# Altium project SERVO.PrjPcb
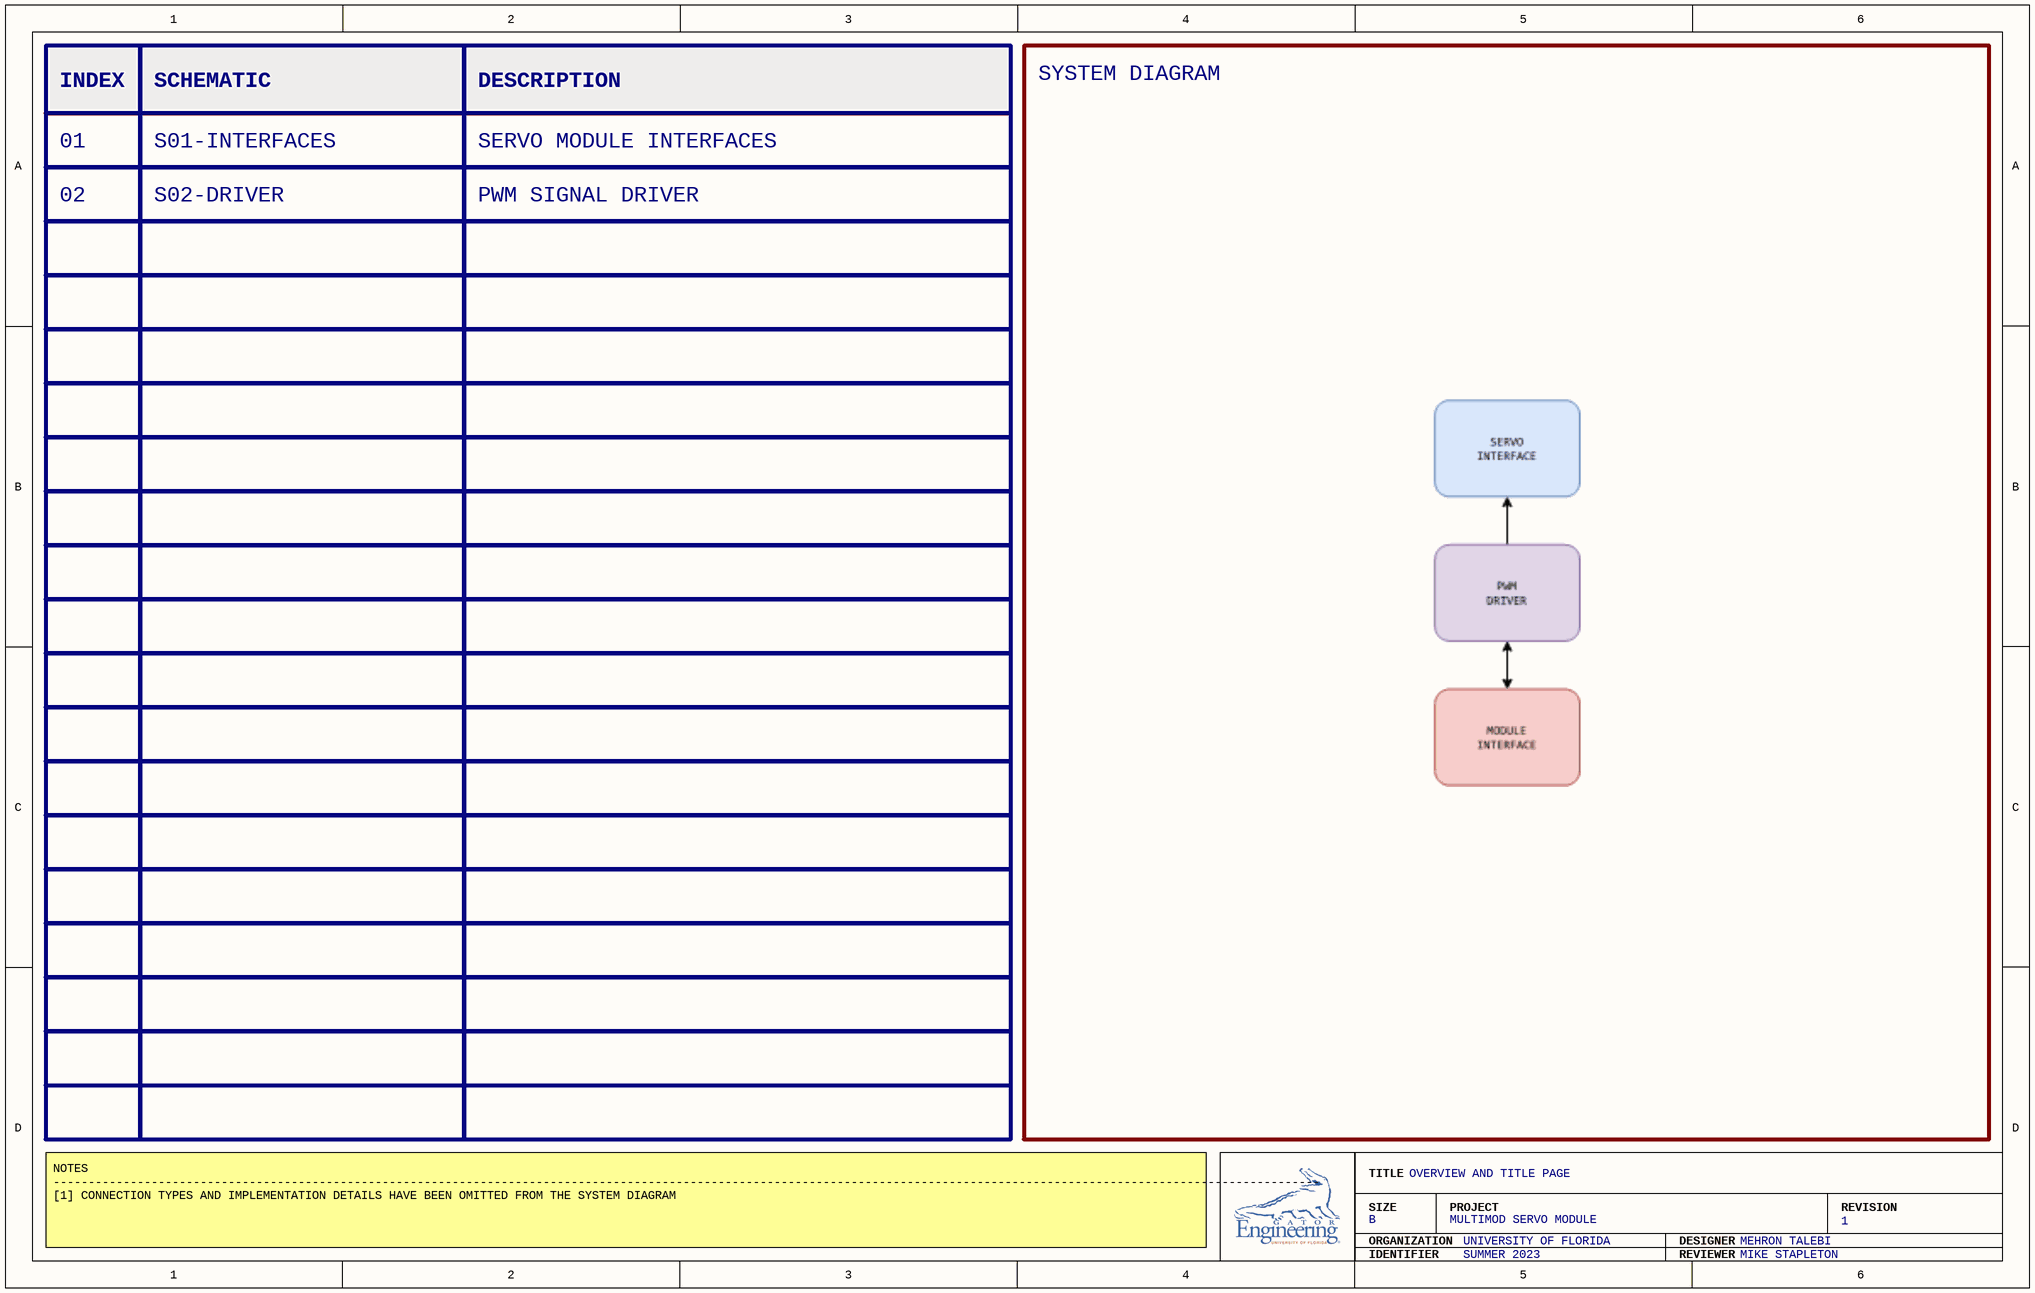
[diagram p0: S00-OVERVIEW.SchDoc]
3 sheets, 16 parts. Net scope: flat (ports and power ports of the same name join across sheets).
Board file: P01-SERVO.PcbDoc
Sheets:
  S00-OVERVIEW.SchDoc
  S01-INTERFACES.SchDoc
  S02-DRIVER.SchDoc

## Sheet S00-OVERVIEW.SchDoc
size B; SheetNumber: 1; SheetTotal: 3; BLOCK-TITLE: OVERVIEW AND TITLE PAGE; BLOCK-SIZE: B; BLOCK-PROJECT: MULTIMOD SERVO MODULE; BLOCK-REVISION: 1; BLOCK-ORGANIZATION: UNIVERSITY OF FLORIDA; BLOCK-DESIGNER: MEHRON TALEBI; BLOCK-IDENTIFIER: SUMMER 2023; BLOCK-REVIEWER: MIKE STAPLETON

### Notes on the sheet
- INDEX
- SCHEMATIC
- DESCRIPTION
- SYSTEM DIAGRAM
- 01
- S01-INTERFACES
- SERVO MODULE INTERFACES
- 02
- S02-DRIVER
- PWM SIGNAL DRIVER
- NOTES
  -------------------------------------------------------------------------------------------------------------------------------------------------------------------------------------
  [1] CONNECTION TYPES AND IMPLEMENTATION DETAILS HAVE BEEN OMITTED FROM THE SYSTEM DIAGRAM
- TITLE
- SIZE
- ORGANIZATION
- PROJECT
- DESIGNER
- REVISION
- IDENTIFIER
- REVIEWER

## Sheet S01-INTERFACES.SchDoc
size B; SheetNumber: 2; SheetTotal: 3; BLOCK-TITLE: SERVO MODULE INTERFACES; BLOCK-SIZE: B; BLOCK-PROJECT: MULTIMOD SERVO MODULE; BLOCK-REVISION: 1; BLOCK-ORGANIZATION: UNIVERSITY OF FLORIDA; BLOCK-DESIGNER: MEHRON TALEBI; BLOCK-IDENTIFIER: SUMMER 2023; BLOCK-REVIEWER: MIKE STAPLETON
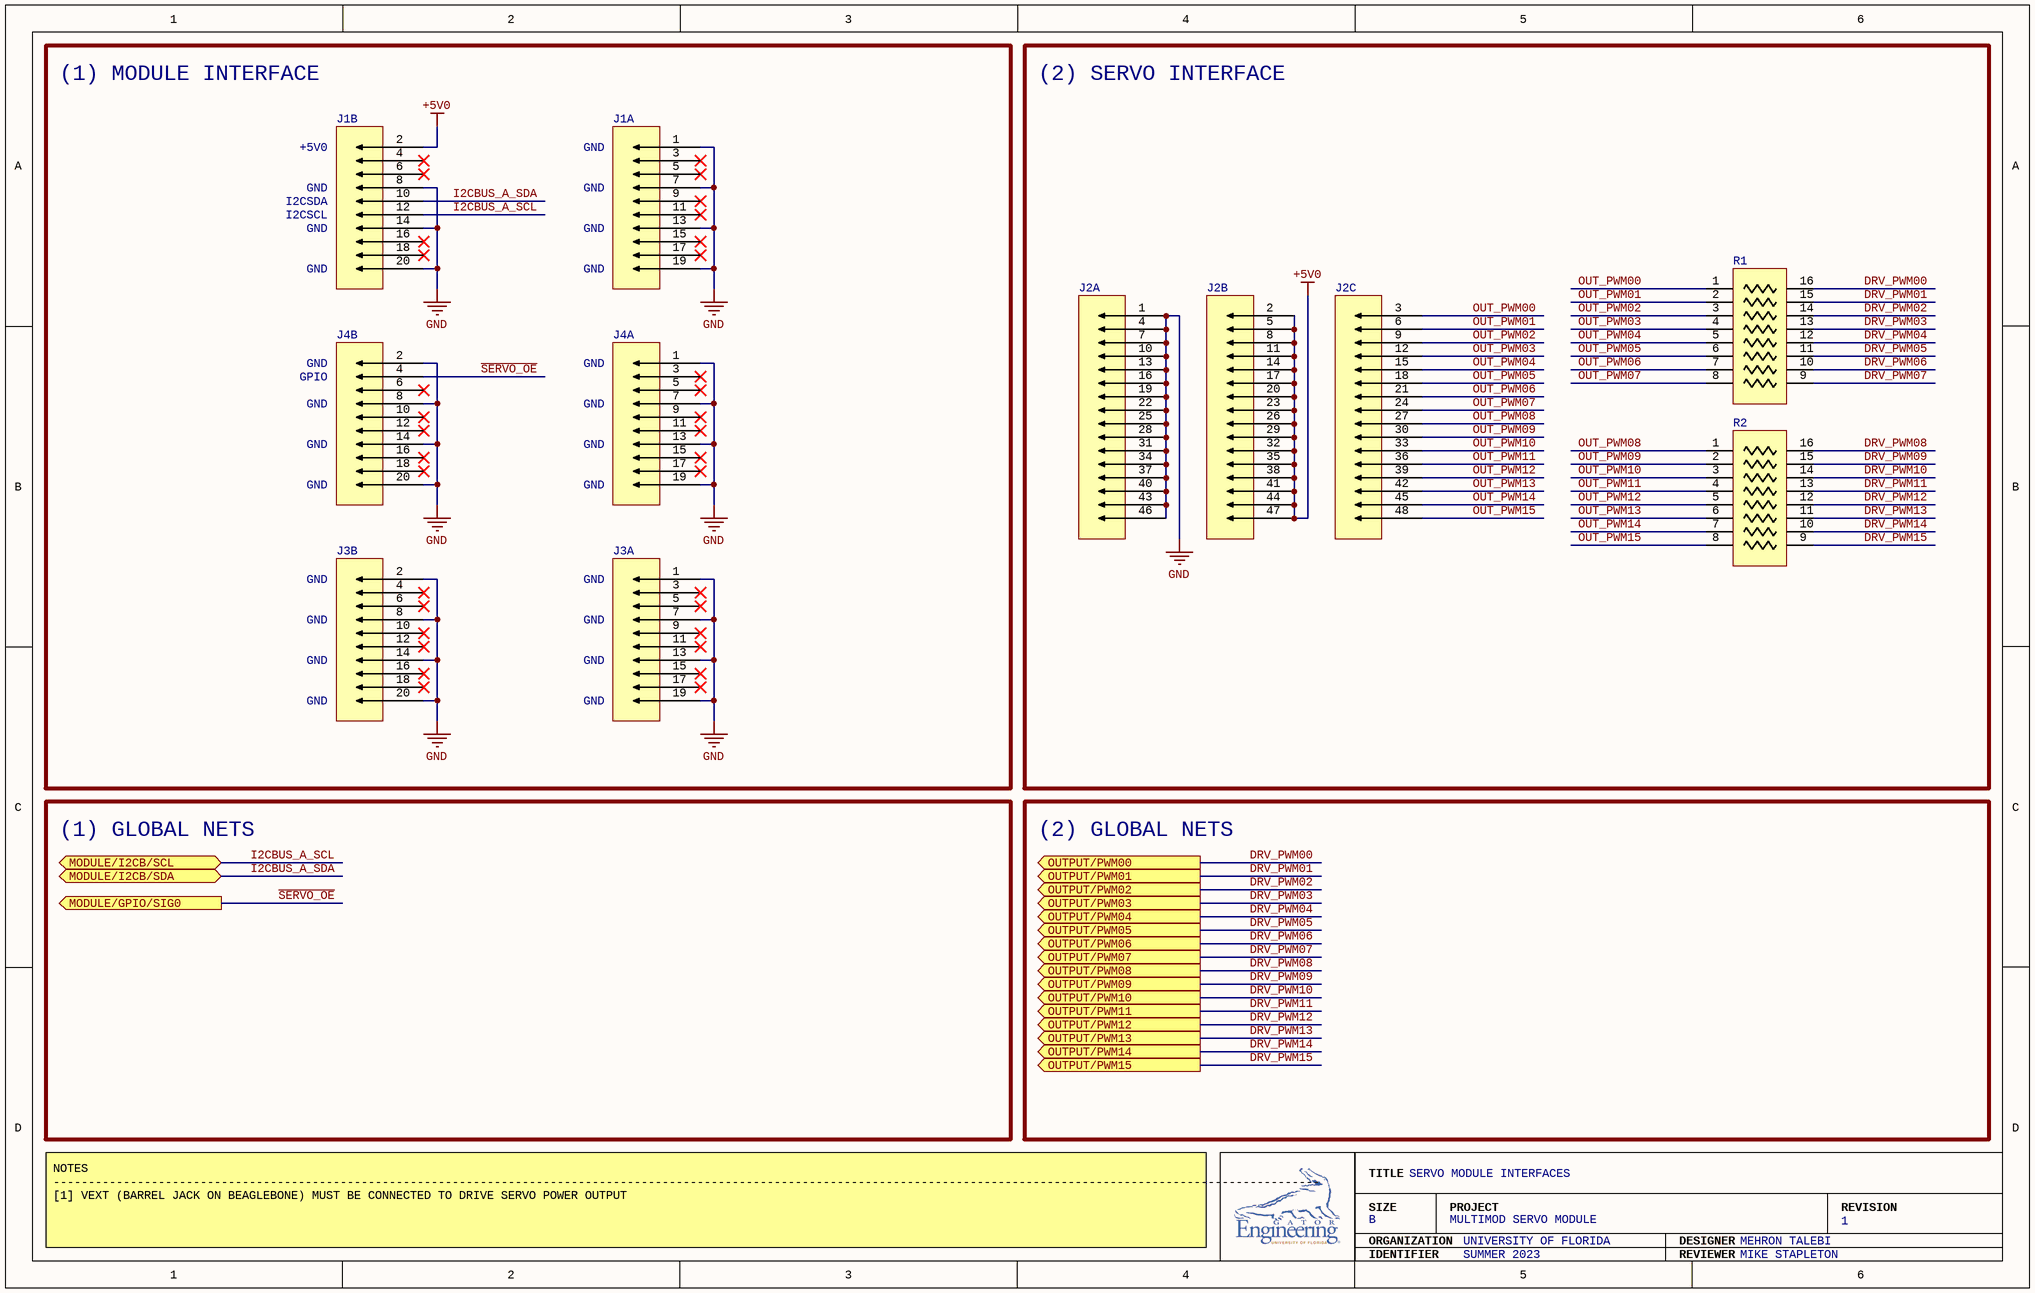
[diagram p1: S01-INTERFACES.SchDoc]

### Parts
J1  NPTC102KFMS-RC  [NPTC102KFMS-RC]  (value not drawn)  (parts A,B of 2)
J2  TSW-116-07-L-T  [TSW-116-07-L-T]  (value not drawn)  (parts A,B,C of 3)
J3  NPTC102KFMS-RC  [NPTC102KFMS-RC]  (value not drawn)  (parts A,B of 2)
J4  NPTC102KFMS-RC  [NPTC102KFMS-RC]  (value not drawn)  (parts A,B of 2)
R1  EXB-2HV221JV  [EXB-2HV221JV]  (value not drawn)
R2  EXB-2HV221JV  [EXB-2HV221JV]  (value not drawn)

### Blocks framed on the sheet
(1) MODULE INTERFACE: J1 J3 J4
(2) SERVO INTERFACE: J2 R1 R2

### Ports
MODULE/GPIO/SIG0 (out), MODULE/I2CB/SCL (bidir), MODULE/I2CB/SDA (bidir), OUTPUT/PWM00 (out), OUTPUT/PWM01 (out), OUTPUT/PWM02 (out), OUTPUT/PWM03 (out), OUTPUT/PWM04 (out), OUTPUT/PWM05 (out), OUTPUT/PWM06 (out), OUTPUT/PWM07 (out), OUTPUT/PWM08 (out), OUTPUT/PWM09 (out), OUTPUT/PWM10 (out), OUTPUT/PWM11 (out), OUTPUT/PWM12 (out), OUTPUT/PWM13 (out), OUTPUT/PWM14 (out), OUTPUT/PWM15 (out)

### Nets
+5V0: J1.2 J2.2 J2.5 J2.8 J2.11 J2.14 J2.17 J2.20 J2.23 J2.26 J2.29 J2.32 J2.35 J2.38 J2.41 J2.44 J2.47
GND: J1.1 J1.7 J1.8 J1.13 J1.14 J1.19 J1.20 J2.1 J2.4 J2.7 J2.10 J2.13 J2.16 J2.19 J2.22 J2.25 J2.28 J2.31 J2.34 J2.37 J2.40 J2.43 J2.46 J3.1 J3.2 J3.7 J3.8 J3.13 J3.14 J3.19 J3.20 J4.1 J4.2 J4.7 J4.8 J4.13 J4.14 J4.19 J4.20
~{SERVO_OE}: J4.4 ; port MODULE/GPIO/SIG0
DRV_PWM00: R1.16 ; port OUTPUT/PWM00
DRV_PWM01: R1.15 ; port OUTPUT/PWM01
DRV_PWM02: R1.14 ; port OUTPUT/PWM02
DRV_PWM03: R1.13 ; port OUTPUT/PWM03
DRV_PWM04: R1.12 ; port OUTPUT/PWM04
DRV_PWM05: R1.11 ; port OUTPUT/PWM05
DRV_PWM06: R1.10 ; port OUTPUT/PWM06
DRV_PWM07: R1.9 ; port OUTPUT/PWM07
DRV_PWM08: R2.16 ; port OUTPUT/PWM08
DRV_PWM09: R2.15 ; port OUTPUT/PWM09
DRV_PWM10: R2.14 ; port OUTPUT/PWM10
DRV_PWM11: R2.13 ; port OUTPUT/PWM11
DRV_PWM12: R2.12 ; port OUTPUT/PWM12
DRV_PWM13: R2.11 ; port OUTPUT/PWM13
DRV_PWM14: R2.10 ; port OUTPUT/PWM14
DRV_PWM15: R2.9 ; port OUTPUT/PWM15
I2CBUS_A_SCL: J1.12 ; port MODULE/I2CB/SCL
I2CBUS_A_SDA: J1.10 ; port MODULE/I2CB/SDA
OUT_PWM00: J2.3 R1.1
OUT_PWM01: J2.6 R1.2
OUT_PWM02: J2.9 R1.3
OUT_PWM03: J2.12 R1.4
OUT_PWM04: J2.15 R1.5
OUT_PWM05: J2.18 R1.6
OUT_PWM06: J2.21 R1.7
OUT_PWM07: J2.24 R1.8
OUT_PWM08: J2.27 R2.1
OUT_PWM09: J2.30 R2.2
OUT_PWM10: J2.33 R2.3
OUT_PWM11: J2.36 R2.4
OUT_PWM12: J2.39 R2.5
OUT_PWM13: J2.42 R2.6
OUT_PWM14: J2.45 R2.7
OUT_PWM15: J2.48 R2.8

Not connected (* = marked no-connect by the designer): J1 3* 4* 5* 6* 9* 11* 15* 16* 17* 18*; J3 3* 4* 5* 6* 9* 10* 11* 12* 15* 16* 17* 18*; J4 3* 5* 6* 9* 10* 11* 12* 15* 16* 17* 18*

### Notes on the sheet
- +5V0
- GND
- I2CSCL
- I2CSDA
- GPIO
- (1) GLOBAL NETS
- (2) GLOBAL NETS
- NOTES
  -------------------------------------------------------------------------------------------------------------------------------------------------------------------------------------
  [1] VEXT (BARREL JACK ON BEAGLEBONE) MUST BE CONNECTED TO DRIVE SERVO POWER OUTPUT
- TITLE
- SIZE
- ORGANIZATION
- PROJECT
- DESIGNER
- REVISION
- IDENTIFIER
- REVIEWER

### Library data of the parts
J1 J3 J4 = NPTC102KFMS-RC: CONN HDR 20POS 0.1 TIN SMD; Connector Type: Header; Style: Board to Board; Number of Positions: 20; Number of Positions Loaded: All; Pitch - Mating: 0.100" (2.54mm); Material Flammability Rating: UL94 V-0; Current Rating (Amps): 3A; Voltage Rating: 250V; System: Connector; Contact Type: Female Socket; Number of Rows: 2; Row Spacing - Mating: 0.100" (2.54mm); Mounting Type: Surface Mount; Termination: Solder; Fastening Type: Push-Pull; Contact Finish - Mating: Tin; Insulation Color: Black; Insulation Height: 0.299" (7.60mm); Operating Temperature: -40°C ~ 125°C; Contact Finish - Post: Tin; Insulation Material: Polyamide (PA6T), Nylon 6T; Contact Shape: Square; Contact Material: Phosphor Bronze; Supplier 1: Digi-Key; Supplier Part Number 1: S5680-ND
J2 = TSW-116-07-L-T: CONN HEADER VERT 48POS 2.54MM; Pitch - Mating: 0.100" (2.54mm); Number of Positions: 48; Number of Positions Loaded: All; Style: Board to Board or Cable; Shrouding: Unshrouded; Contact Length - Mating: 0.230" (5.84mm); Material Flammability Rating: UL94 V-0; Connector Type: Header; Contact Type: Male Pin; Number of Rows: 3; Row Spacing - Mating: 0.100" (2.54mm); Mounting Type: Through Hole, Right Angle; Termination: Solder; Fastening Type: Push-Pull; Contact Length - Post: 0.100" (2.54mm); Insulation Height: 0.100" (2.54mm); Contact Shape: Square; Contact Finish - Mating: Gold; Contact Finish Thickness - Mating: 10.0µin (0.25µm); Contact Finish - Post: Gold; Contact Material: Phosphor Bronze; Insulation Material: Polybutylene Terephthalate (PBT); Operating Temperature: -55°C ~ 125°C; Insulation Color: Black; Contact Finish Thickness - Post: 10.0µin (0.25µm); Supplier 1: Digi-Key; Supplier Part Number 1: SAM12360-ND
R1 R2 = EXB-2HV221JV: RES ARRAY 8 RES 220 OHM 1506; Circuit Type: Isolated; Resistance (Ohms): 220; Tolerance: ±5%; Number of Resistors: 8; Power Per Element: 62.5mW; Temperature Coefficient: ±200ppm/°C; Number of Pins: 16; Operating Temperature: -55°C ~ 125°C; Applications: Automotive AEC-Q200; Mounting Type: Surface Mount; Package / Case: 1506, Convex, Long Side Terminals; Size / Dimension: 0.150" L x 0.063" W (3.80mm x 1.60mm); Height - Seated (Max): 0.022" (0.55mm); Supplier 1: Mouser; Supplier Part Number 1: 667-EXB-2HV221JV

## Sheet S02-DRIVER.SchDoc
size B; SheetNumber: 3; SheetTotal: 3; BLOCK-TITLE: PWM SIGNAL DRIVER; BLOCK-SIZE: B; BLOCK-PROJECT: MULTIMOD SERVO MODULE; BLOCK-REVISION: 1; BLOCK-ORGANIZATION: UNIVERSITY OF FLORIDA; BLOCK-DESIGNER: MEHRON TALEBI; BLOCK-IDENTIFIER: SUMMER 2023; BLOCK-REVIEWER: MIKE STAPLETON
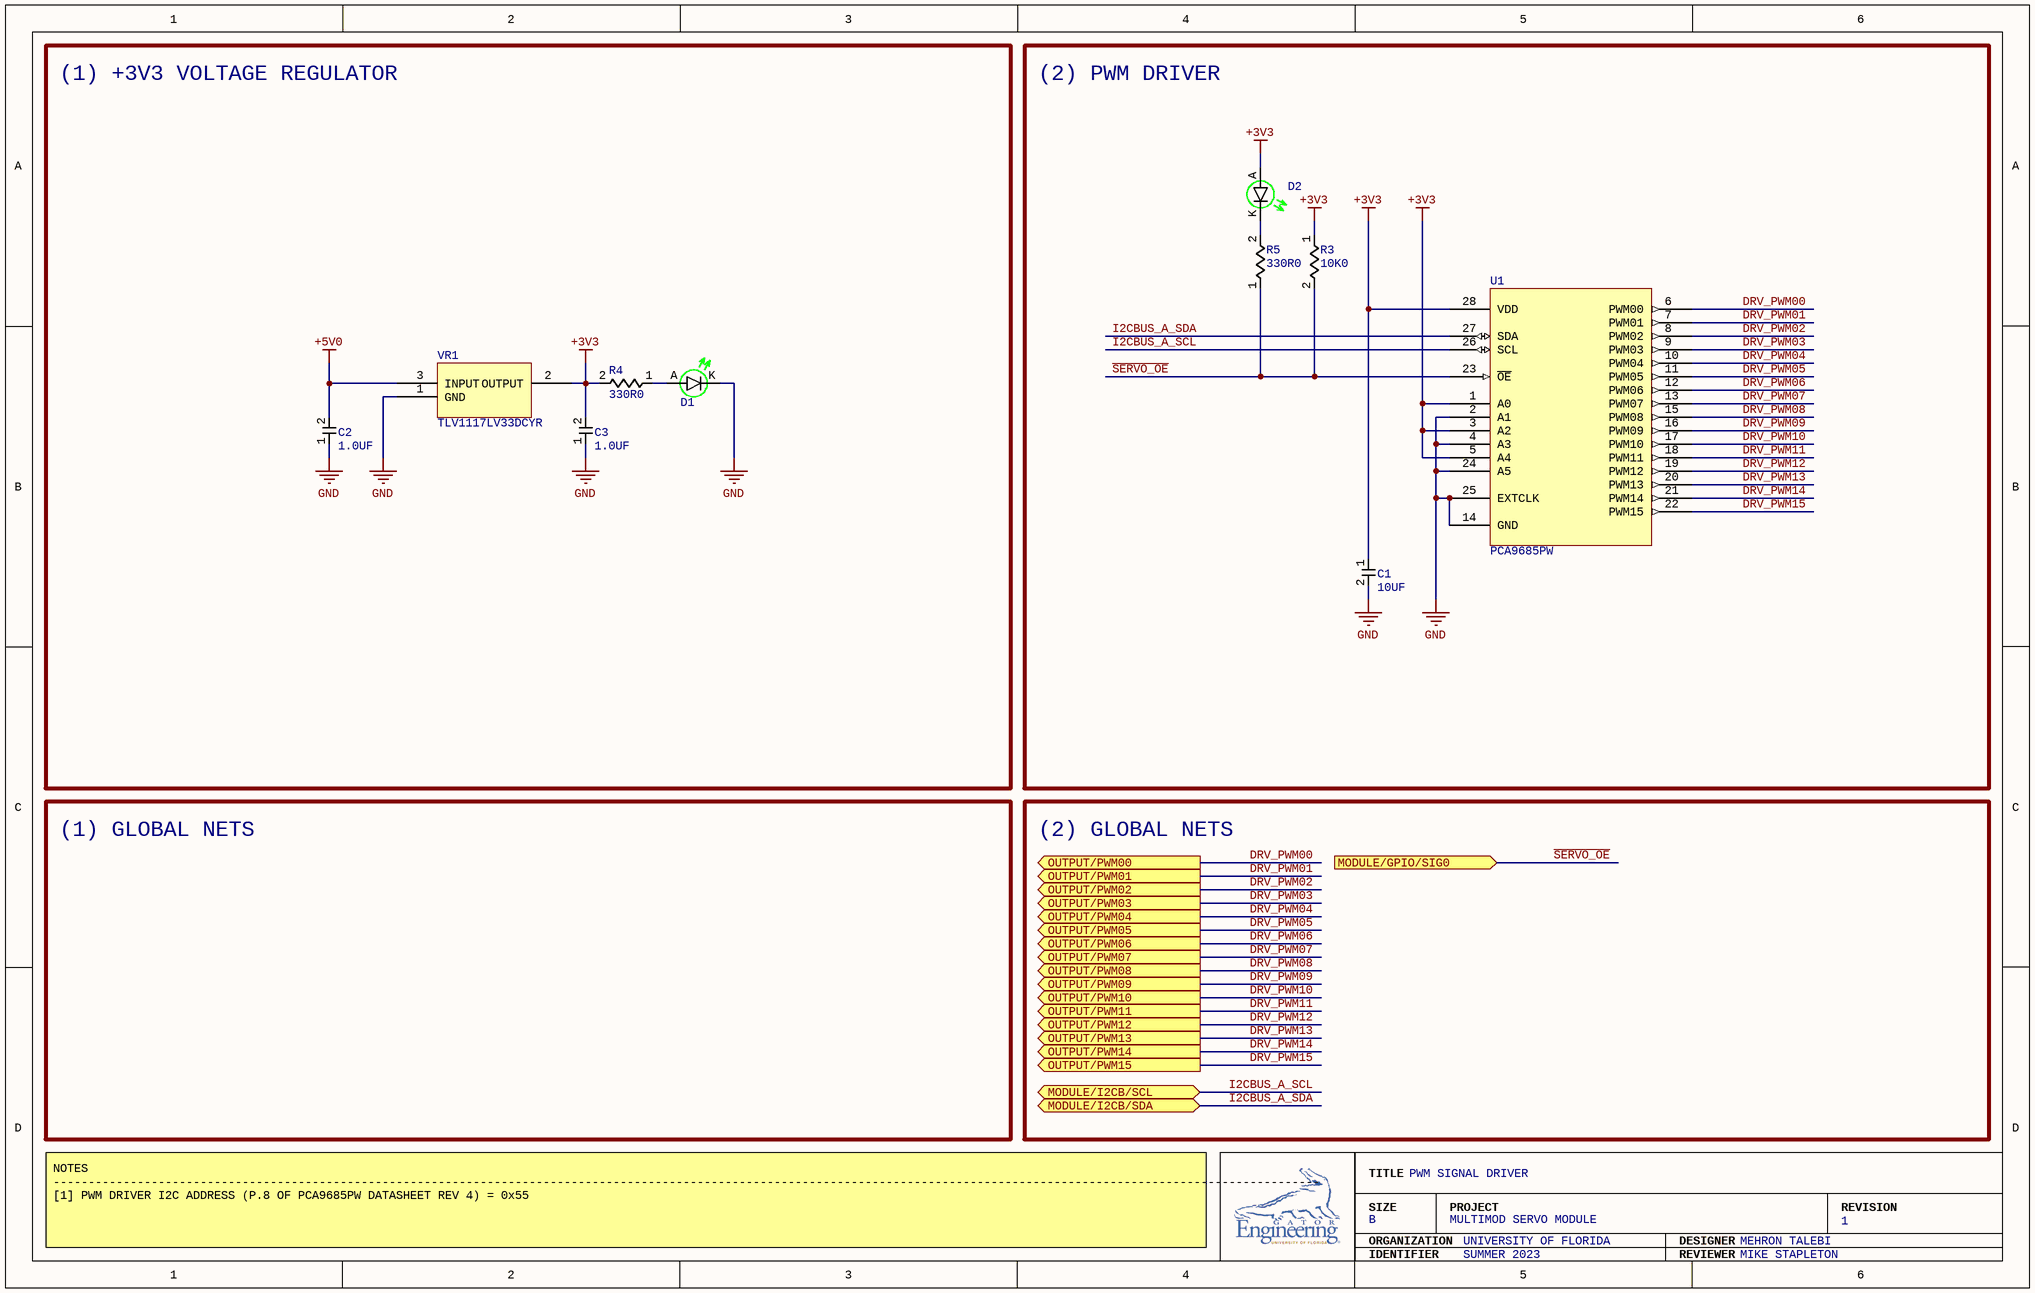
[diagram p2: S02-DRIVER.SchDoc]

### Parts
C1  10UF  [CL21B106KPQNFNE]
C2  1.0UF  [CL21B105KAFNFNE]
C3  1.0UF  [CL21B105KAFNFNE]
D1  LTST-C171GKT  [LTST-C171GKT]  (value not drawn)
D2  LTST-C171GKT  [LTST-C171GKT]  (value not drawn)
R3  10K0  [RC0805FR-0710KL]
R4  330R0  [RC0805FR-7W330RL]
R5  330R0  [RC0805FR-7W330RL]
U1  PCA9685PW  [PCA9685PW]
VR1  TLV1117LV33DCYR  [TLV1117LV33DCYR]

### Blocks framed on the sheet
(1) +3V3 VOLTAGE REGULATOR: C2 C3 D1 R4 VR1
(2) PWM DRIVER: C1 D2 R3 R5 U1

### Ports
MODULE/GPIO/SIG0 (in), MODULE/I2CB/SCL (bidir), MODULE/I2CB/SDA (bidir), OUTPUT/PWM00 (out), OUTPUT/PWM01 (out), OUTPUT/PWM02 (out), OUTPUT/PWM03 (out), OUTPUT/PWM04 (out), OUTPUT/PWM05 (out), OUTPUT/PWM06 (out), OUTPUT/PWM07 (out), OUTPUT/PWM08 (out), OUTPUT/PWM09 (out), OUTPUT/PWM10 (out), OUTPUT/PWM11 (out), OUTPUT/PWM12 (out), OUTPUT/PWM13 (out), OUTPUT/PWM14 (out), OUTPUT/PWM15 (out)

### Nets
+3V3: C1.1 C3.2 D2.A R3.1 R4.2 U1.1(A0) U1.3(A2) U1.5(A4) U1.28(VDD) VR1.2(OUTPUT)
+5V0: C2.2 VR1.3(INPUT)
GND: C1.2 C2.1 C3.1 D1.K U1.2(A1) U1.4(A3) U1.14(GND) U1.24(A5) U1.25(EXTCLK) VR1.1(GND)
~{SERVO_OE}: R3.2 R5.1 U1.23(~{OE}) ; port MODULE/GPIO/SIG0
DRV_PWM00: U1.6(PWM00) ; port OUTPUT/PWM00
DRV_PWM01: U1.7(PWM01) ; port OUTPUT/PWM01
DRV_PWM02: U1.8(PWM02) ; port OUTPUT/PWM02
DRV_PWM03: U1.9(PWM03) ; port OUTPUT/PWM03
DRV_PWM04: U1.10(PWM04) ; port OUTPUT/PWM04
DRV_PWM05: U1.11(PWM05) ; port OUTPUT/PWM05
DRV_PWM06: U1.12(PWM06) ; port OUTPUT/PWM06
DRV_PWM07: U1.13(PWM07) ; port OUTPUT/PWM07
DRV_PWM08: U1.15(PWM08) ; port OUTPUT/PWM08
DRV_PWM09: U1.16(PWM09) ; port OUTPUT/PWM09
DRV_PWM10: U1.17(PWM10) ; port OUTPUT/PWM10
DRV_PWM11: U1.18(PWM11) ; port OUTPUT/PWM11
DRV_PWM12: U1.19(PWM12) ; port OUTPUT/PWM12
DRV_PWM13: U1.20(PWM13) ; port OUTPUT/PWM13
DRV_PWM14: U1.21(PWM14) ; port OUTPUT/PWM14
DRV_PWM15: U1.22(PWM15) ; port OUTPUT/PWM15
I2CBUS_A_SCL: U1.26(SCL) ; port MODULE/I2CB/SCL
I2CBUS_A_SDA: U1.27(SDA) ; port MODULE/I2CB/SDA
NetD1_A: D1.A R4.1
NetD2_K: D2.K R5.2

### Notes on the sheet
- (1) GLOBAL NETS
- (2) GLOBAL NETS
- NOTES
  -------------------------------------------------------------------------------------------------------------------------------------------------------------------------------------
  [1] PWM DRIVER I2C ADDRESS (P.8 OF PCA9685PW DATASHEET REV 4) = 0x55
- TITLE
- SIZE
- ORGANIZATION
- PROJECT
- DESIGNER
- REVISION
- IDENTIFIER
- REVIEWER

### Library data of the parts
C1 = CL21B106KPQNFNE: CAP CER 10UF 10V X7R 0805; Capacitance: 10 µF; Tolerance: ±10%; Voltage - Rated: 10V; Temperature Coefficient: X7R; Operating Temperature: -55°C ~ 125°C; Applications: General Purpose; Mounting Type: Surface Mount, MLCC; Package / Case: 0805 (2012 Metric); Size / Dimension: 0.079" L x 0.049" W (2.00mm x 1.25mm); Thickness (Max): 0.053" (1.35mm); Supplier 1: Arrow Electronics; Supplier Part Number 1: CL21B106KPQNFNE
C2 C3 = CL21B105KAFNFNE: CAP CER 1UF 25V X7R 0805; Capacitance: 1 µF; Tolerance: ±10%; Voltage - Rated: 25V; Temperature Coefficient: X7R; Operating Temperature: -55°C ~ 125°C; Applications: General Purpose; Mounting Type: Surface Mount, MLCC; Package / Case: 0805 (2012 Metric); Size / Dimension: 0.079" L x 0.049" W (2.00mm x 1.25mm); Thickness (Max): 0.053" (1.35mm); Supplier 1: Arrow Electronics; Supplier Part Number 1: CL21B105KAFNFNE
D1 D2 = LTST-C171GKT: LED GREEN CLEAR CHIP SMD; Configuration: Standard; Lens Color: Colorless; Millicandela Rating: 12mcd; Lens Style: Rectangle with Flat Top; Lens Size: 1.40mm x 1.25mm; Voltage - Forward (Vf) (Typ): 2.1V; Current - Test: 20mA; Viewing Angle: 130°; Wavelength - Dominant: 569nm; Wavelength - Peak: 565nm; Color: Green; Lens Transparency: Clear; Mounting Type: Surface Mount; Package / Case: 0805 (2012 Metric); Supplier Device Package: Chip LED; Size / Dimension: 2.00mm L x 1.25mm W; Height (Max): 0.90mm; Supplier 1: Digi-Key; Supplier Part Number 1: 160-1423-1-ND
R3 = RC0805FR-0710KL: RES 10K OHM 1% 1/8W 0805; Resistance: 10 kOhms; Power (Watts): 0.125W, 1/8W; Temperature Coefficient: ±100ppm/°C; Tolerance: ±1%; Composition: Thick Film; Features: Moisture Resistant; Operating Temperature: -55°C ~ 155°C; Package / Case: 0805 (2012 Metric); Supplier Device Package: 0805; Size / Dimension: 0.079" L x 0.049" W (2.00mm x 1.25mm); Height - Seated (Max): 0.024" (0.60mm); Number of Terminations: 2; Supplier 1: Future Electronics; Supplier Part Number 1: 3310877
R4 R5 = RC0805FR-7W330RL: RES 330 OHM 1% 1/4W 0805; Resistance: 330 Ohms; Power (Watts): 0.25W, 1/4W; Temperature Coefficient: ±100ppm/°C; Tolerance: ±1%; Composition: Thick Film; Features: Moisture Resistant; Operating Temperature: -55°C ~ 155°C; Supplier Device Package: 0805; Size / Dimension: 0.079" L x 0.049" W (2.00mm x 1.25mm); Height - Seated (Max): 0.024" (0.60mm); Number of Terminations: 2; Supplier 1: Mouser; Supplier Part Number 1: 603-RC0805FR-7W330RL
U1 = PCA9685PW: IC LED DRVR LIN PWM 25MA 28TSSOP; Internal Switch(s): Yes; Number of Outputs: 16; Voltage - Supply (Min): 2.3V; Voltage - Supply (Max): 5.5V; Frequency: 100kHz ~ 1MHz; Type: Linear; Voltage - Output: 5.5V; Current - Output / Channel: 25mA; Dimming: PWM; Applications: Backlight; Operating Temperature: -40°C ~ 85°C (TA); Mounting Type: Surface Mount; Package / Case: 28-TSSOP (0.173", 4.40mm Width); Supplier 1: Arrow Electronics; Supplier Part Number 1: PCA9685PW,118
VR1 = TLV1117LV33DCYR: IC REG LINEAR 3.3V 1A SOT223-4; Output Configuration: Positive; Output Type: Fixed; Number of Regulators: 1; Voltage - Input (Max): 5.5V; Voltage Dropout (Max): 1.3V @ 800mA; Current - Quiescent (Iq): 100 µA; PSRR: 75dB (120Hz); Protection Features: Over Current, Over Temperature; Voltage - Output (Min/Fixed): 3.3V; Current - Output: 1A; Operating Temperature: -40°C ~ 125°C; Mounting Type: Surface Mount; Package / Case: TO-261-4, TO-261AA; ComponentLink1Description: Datasheet; ComponentLink1URL: https://www.ti.com/lit/ds/symlink/tlv1117lv.pdf; Supplier 1: Digi-Key; Supplier Part Number 1: 296-28778-1-ND

## Nets that join several sheets
+5V0: S01-INTERFACES (17 pins), S02-DRIVER (C2.2 VR1.3)
GND: S01-INTERFACES (39 pins), S02-DRIVER (10 pins)
~{SERVO_OE}: S01-INTERFACES (J4.4), S02-DRIVER (R3.2 R5.1 U1.23)
DRV_PWM00: S01-INTERFACES (R1.16), S02-DRIVER (U1.6)
DRV_PWM01: S01-INTERFACES (R1.15), S02-DRIVER (U1.7)
DRV_PWM02: S01-INTERFACES (R1.14), S02-DRIVER (U1.8)
DRV_PWM03: S01-INTERFACES (R1.13), S02-DRIVER (U1.9)
DRV_PWM04: S01-INTERFACES (R1.12), S02-DRIVER (U1.10)
DRV_PWM05: S01-INTERFACES (R1.11), S02-DRIVER (U1.11)
DRV_PWM06: S01-INTERFACES (R1.10), S02-DRIVER (U1.12)
DRV_PWM07: S01-INTERFACES (R1.9), S02-DRIVER (U1.13)
DRV_PWM08: S01-INTERFACES (R2.16), S02-DRIVER (U1.15)
DRV_PWM09: S01-INTERFACES (R2.15), S02-DRIVER (U1.16)
DRV_PWM10: S01-INTERFACES (R2.14), S02-DRIVER (U1.17)
DRV_PWM11: S01-INTERFACES (R2.13), S02-DRIVER (U1.18)
DRV_PWM12: S01-INTERFACES (R2.12), S02-DRIVER (U1.19)
DRV_PWM13: S01-INTERFACES (R2.11), S02-DRIVER (U1.20)
DRV_PWM14: S01-INTERFACES (R2.10), S02-DRIVER (U1.21)
DRV_PWM15: S01-INTERFACES (R2.9), S02-DRIVER (U1.22)
I2CBUS_A_SCL: S01-INTERFACES (J1.12), S02-DRIVER (U1.26)
I2CBUS_A_SDA: S01-INTERFACES (J1.10), S02-DRIVER (U1.27)